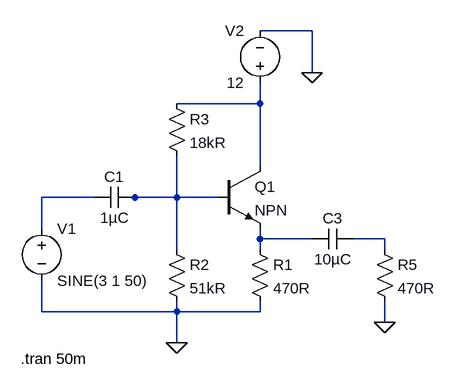
[diagram p0: schematic collector_circuit.asc]
collector_circuit.asc, the LTspice schematic file:
Version 4
SHEET 1 880 680
WIRE 240 -128 160 -128
WIRE 240 -64 240 -128
WIRE 160 -16 160 -48
WIRE 160 -16 32 -16
WIRE 160 80 160 -16
WIRE -96 128 -176 128
WIRE -32 128 -48 128
WIRE 32 128 32 64
WIRE 32 128 -32 128
WIRE 96 128 32 128
WIRE -176 176 -176 128
WIRE 160 192 160 176
WIRE 240 192 160 192
WIRE 352 192 304 192
WIRE 32 208 32 128
WIRE 160 208 160 192
WIRE 352 208 352 192
WIRE -176 304 -176 256
WIRE 32 304 32 288
WIRE 32 304 -176 304
WIRE 160 304 160 288
WIRE 160 304 32 304
WIRE 352 320 352 288
WIRE 32 352 32 304
FLAG 32 352 0
FLAG 240 -64 0
FLAG 352 320 0
SYMBOL npn 96 80 R0
SYMATTR InstName Q1
SYMBOL res 144 192 R0
SYMATTR InstName R1
SYMATTR Value 470R
SYMBOL res 16 192 R0
SYMATTR InstName R2
SYMATTR Value 51kR
SYMBOL res 16 -32 R0
SYMATTR InstName R3
SYMATTR Value 18kR
SYMBOL cap -32 112 R90
WINDOW 0 0 32 VBottom 2
WINDOW 3 32 32 VTop 2
SYMATTR InstName C1
SYMATTR Value 1µC
SYMBOL voltage -176 160 R0
WINDOW 123 0 0 Left 0
WINDOW 39 0 0 Left 0
SYMATTR InstName V1
SYMATTR Value SINE(3 1 50)
SYMBOL voltage 160 -32 R180
WINDOW 0 24 96 Left 2
WINDOW 3 24 16 Left 2
WINDOW 123 0 0 Left 0
WINDOW 39 0 0 Left 0
SYMATTR InstName V2
SYMATTR Value 12
SYMBOL cap 304 176 R90
WINDOW 0 0 32 VBottom 2
WINDOW 3 32 32 VTop 2
SYMATTR InstName C3
SYMATTR Value 10µC
SYMBOL res 336 192 R0
SYMATTR InstName R5
SYMATTR Value 470R
TEXT -208 376 Left 2 !.tran 50m

The netlist it stands for:
* collector_circuit.asc
Q1 N001 N003 N004 0 NPN
R1 N004 0 470R
R2 N003 0 51kR
R3 N001 N003 18kR
C1 N003 N002 1µC
V1 N002 0 SINE(3 1 50)
V2 N001 0 12
C3 N005 N004 10µC
R5 N005 0 470R
.model NPN NPN
.model PNP PNP
.lib standard.bjt
.tran 50m
.backanno
.end